# EAGLE design base_module_e1_0.2 (EAGLE 9.2.2)
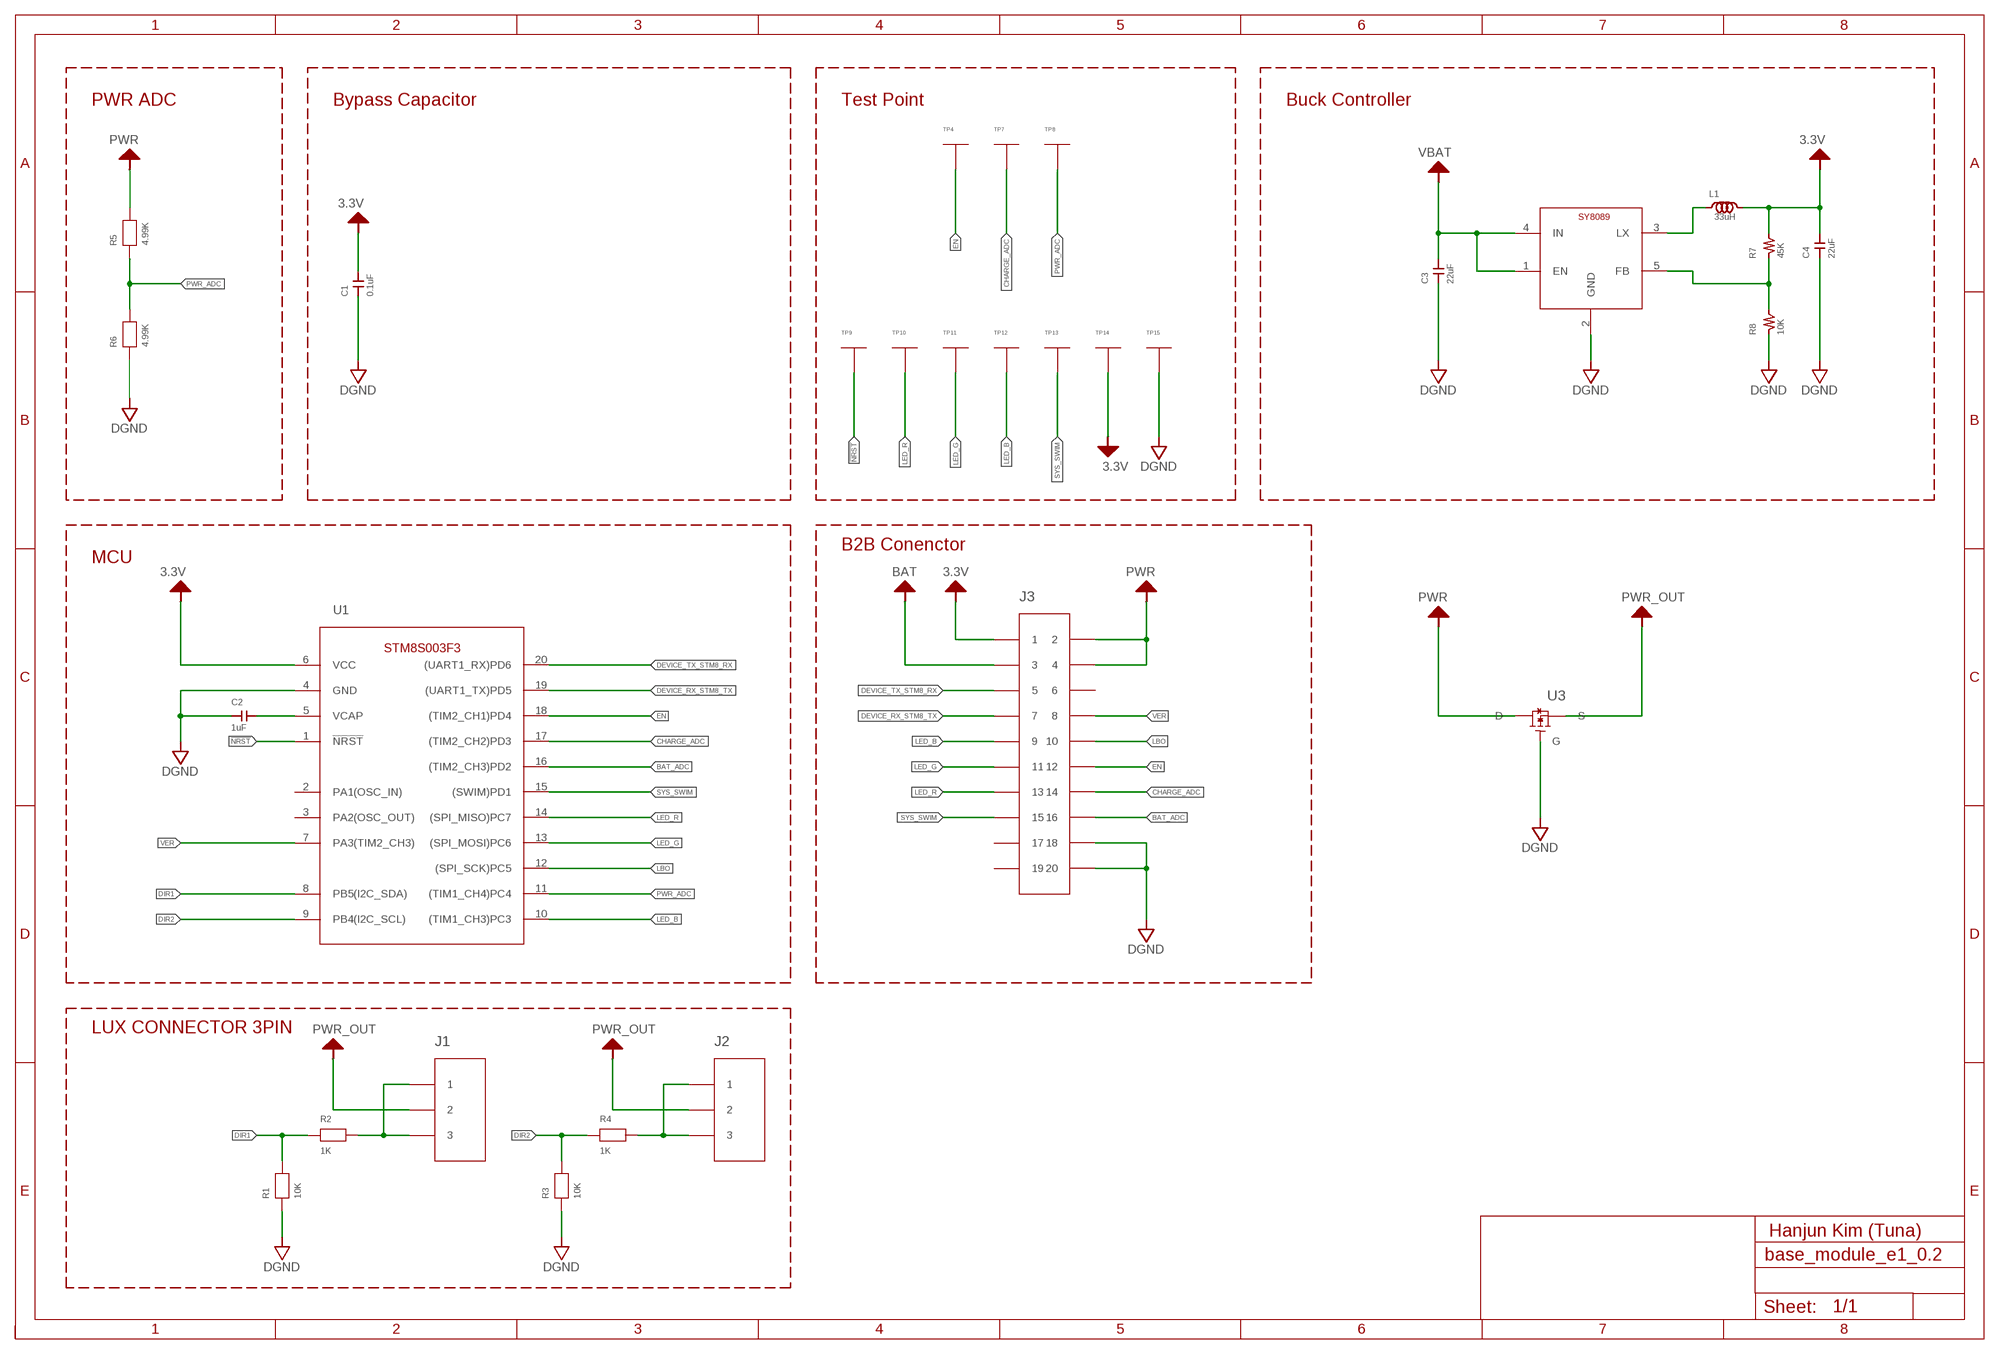
[diagram p0: schematic, sheet 1]

## Parts
C1  0.1uF  CAPACITOR_CHIP1005  [1005]
C2  1uF  CAPACITOR_CHIP1005  [1005]
C3  22uF  CAPACITOR_CHIP1608  [1608]
C4  22uF  CAPACITOR_CHIP1608  [1608]
J1  MODI_CONNECTOR_BOTTOM  [3P]
J2  MODI_CONNECTOR_BOTTOM  [3P]
J3  AXK720447G  [SOCKET_20P]
L1  33uH  INDUCTOR2518  [2518]
LOGO1  LOGO_LUXROBO_PCB  [PCB_LUXROBO_6.5X2.5]
LOGO2  LOGO_MODI_PCB6.5X2.5  [PCB_MODI_6.5X2.5]
P1  MODI_BAT_BASE  [BAT_BASE]
R1  10K  RESISTOR_CHIP_SMALL1005  [1005]
R2  1K  RESISTOR_CHIP_SMALL1005  [1005]
R3  10K  RESISTOR_CHIP_SMALL1005  [1005]
R4  1K  RESISTOR_CHIP_SMALL1005  [1005]
R5  4.99K  RESISTOR_CHIP_SMALL1005  [1005]
R6  4.99K  RESISTOR_CHIP_SMALL1005  [1005]
R7  45K  RESISTOR_CHIP_1005  [1005]
R8  10K  RESISTOR_CHIP_1005  [1005]
TP4  TEST_POINT_1.2MM_PAD  [1.2MM_PAD]
TP7  TEST_POINT_1.2MM_PAD  [1.2MM_PAD]
TP8  TEST_POINT_1.2MM_PAD  [1.2MM_PAD]
TP9  TEST_POINT_1.2MM_PAD  [1.2MM_PAD]
TP10  TEST_POINT_1.2MM_PAD  [1.2MM_PAD]
TP11  TEST_POINT_1.2MM_PAD  [1.2MM_PAD]
TP12  TEST_POINT_1.2MM_PAD  [1.2MM_PAD]
TP13  TEST_POINT  [0.7MM_HOLE]
TP14  TEST_POINT  [0.7MM_HOLE]
TP15  TEST_POINT  [0.7MM_HOLE]
U1  STM8S003FXU6  [UFQFPN20]
U2  SY8089  [SOT-23-5]
U3  PMXBXXXXPE  [DFN1010D-3]

## Nets
3.3V: C1.P$2 C4.P$2 J3.P1 L1.P$2 R7.P$2 TP14.1 U1.6(VCC)
!NRST!: TP9.P1 U1.1(!NRST!)
BAT_ADC: J3.P16 U1.16((TIM2_CH3)PD2)
CHARGE_ADC: J3.P14 TP7.P1 U1.17((TIM2_CH2)PD3)
DEVICE_RX_STM8_TX: J3.P7 U1.19((UART1_TX)PD5)
DEVICE_TX_STM8_RX: J3.P5 U1.20((UART1_RX)PD6)
DGND: C1.P$1 C2.P$1 C3.P$1 C4.P$1 J3.P18 J3.P20 R1.P$1 R3.P$1 R6.P$1 R8.P$1 TP15.1 U1.4(GND) U2.2(GND) U3.P1(G)
DIR1: R1.P$2 R2.P$1 U1.8(PB5(I2C_SDA))
DIR2: R3.P$2 R4.P$1 U1.9(PB4(I2C_SCL))
EN: J3.P12 TP4.P1 U1.18((TIM2_CH1)PD4)
LBO: J3.P10 U1.12((SPI_SCK)PC5)
LED_B: J3.P9 TP12.P1 U1.10((TIM1_CH3)PC3)
LED_G: J3.P11 TP11.P1 U1.13((SPI_MOSI)PC6)
LED_R: J3.P13 TP10.P1 U1.14((SPI_MISO)PC7)
N$1: J2.P1 J2.P3 R4.P$2
N$3: J1.P1 J1.P3 R2.P$2
N$4: R7.P$1 R8.P$2 U2.5(FB)
N$5: L1.P$1 U2.3(LX)
PWR: J3.P2 J3.P4 R5.P$2 U3.P3(D)
PWR_ADC: R5.P$1 R6.P$2 TP8.P1 U1.11((TIM1_CH4)PC4)
PWR_OUT: J1.P2 J2.P2 U3.P2(S)
SYS_SWIM: J3.P15 TP13.1 U1.15((SWIM)PD1)
VBAT: C3.P$2 J3.P3 U2.1(EN) U2.4(IN) ; supply symbol labelled BAT
VCAP: C2.P$2 U1.5(VCAP)
VER: J3.P8 U1.7(PA3(TIM2_CH3))
Unconnected: J3.P6 J3.P17 J3.P19 U1.2(PA1(OSC_IN)) U1.3(PA2(OSC_OUT))

## Notes on the sheet
- PWR ADC | Bypass Capacitor | Test Point | Buck Controller
- B2B Conenctor
- MCU
- LUX CONNECTOR 3PIN
- Hanjun Kim (Tuna)

## Library data of the parts
C1-C4 = passive:CAPACITOR_CHIP
J1 J2 = MODI_Connector:MODI_CONNECTOR_BOTTOM
J3 = connector-panasonic:AXK7204
L1 = passive:INDUCTOR
LOGO1 = LUX_Logo_new:LOGO_LUXROBO_PCB
LOGO2 = LUX_Logo_new:LOGO_MODI_PCB
P1 = MODI_board:MODI_BAT_BASE
R1-R6 = passive:RESISTOR_CHIP_SMALL
R7 R8 = passive:RESISTOR_CHIP_
TP4 TP7-TP15 = Test:TEST_POINT
U1 = ST-MCU:STM8S003FX: • 16 MHz advanced STM8 core with Harvard architecture and 3-stage pipeline • Extended instruction set Memories • Program memory: 8 Kbyte Flash memory; data retention 20 years at 55 °C after 100 cycles • RAM: 1 Kbyte • Data memory: 128 bytes true data EEPROM; endurance up to 100 k write/erase cycles Clock, reset and supply management • 2.95 V to 5.5 V operating voltage • Flexible clock control, 4 master clock sources – Low-power crystal resonator oscillator – External clock input – Internal, user-trimmable 16 MHz RC – Internal low-power 128 kHz RC • Clock security system with clock monitor • Power management – Low-power modes (wait, active-halt, halt) – Switch-off peripheral clocks individually – Permanently active, low-consumption power-on and power-down reset Interrupt management • Nested interrupt controller with 32 interrupts • Up to 27 external interrupts on 6 vectors
U2 = Regulator:SY8089: The SY8089 and SY8089A are high-efficiency, high frequency synchronous step-down DC-DC regulator IC capable of delivering up to 2A output current. The SY8089 and SY8089A operate over a wide input voltage range from 2.7V to 5.5V and integrate main switch and synchronous switch with very low RDS(ON) to minimize the conduction loss. Low output voltage ripple and small external inductor and capacitor sizes are achieved with greater than 1MHz switching frequency. SY8089 integrates short circuit and over-voltage latch off protection.
U3 = MOSFET:PMXBXXXX

## Board
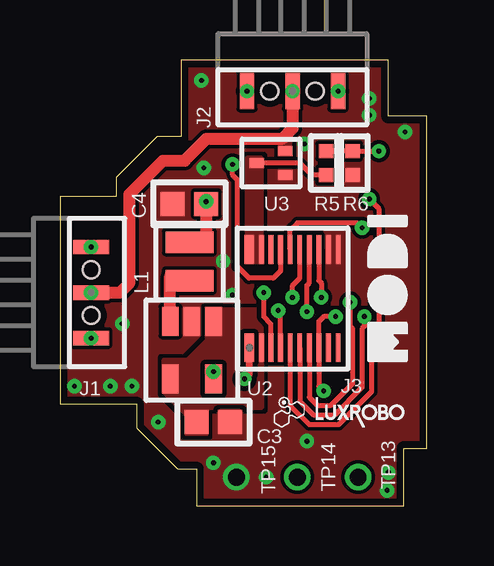
[diagram p1: board, top side]
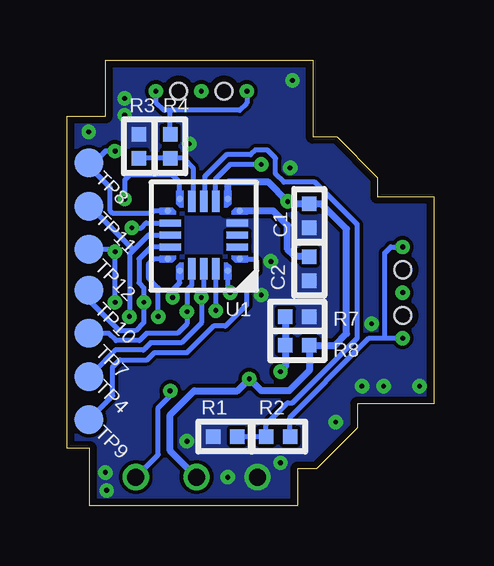
[diagram p2: board, bottom side, seen from below]

Size 15.3 x 18.6 mm. Coordinates in mm from the lower left corner, seen from the top.
Copper layers (1*16): Top 0.035mm / dielectric 0.2mm / Bottom 0.035mm
Design rules "hsdgt3_1oz_2layer *": minimum track width 0.15mm, minimum drill 0.2mm, track to track 0.15mm, track to pad 0.15mm, pad to pad 0.15mm, via to via 0.15mm, smd to smd 0mil, copper to edge 0.3mm, drill to drill 0.2mm, minimum pad ring 0.2mm, minimum via ring 0.2mm, stop-mask expansion 0mil, vias tented up to drill 0.3mm, thermal gap 10mil
bRestrict: 1 lines

### Footprints (pad centres in the part's own frame; a part is rotated, then mirrored left to right if it is on the bottom)
1005 = smd 0.6 x 0.6: P$1 0,0.5; P$2 0,-0.5
1608 = smd 1 x 1: P$1 0,0.7; P$2 0,-0.7
3P = smd 1.5 x 0.6: P1 0,1.9; P2 0,0; P3 0,-1.9 | hole 0.7: 0,-0.95; 0,0.95
SOCKET_20P = smd 1.2 x 0.4: P1 0,0.1; P2 4.1,0.1 | smd 1.2 x 0.2: P3 0,-0.4; P4 4.1,-0.4; P5 0,-0.8; P6 4.1,-0.8; P7 0,-1.2; P8 4.1,-1.2; P9 0,-1.6; P10 4.1,-1.6; P11 0,-2; P12 4.1,-2; P13 0,-2.4; P14 4.1,-2.4; P15 0,-2.8; P16 4.1,-2.8; P17 0,-3.2; P18 4.1,-3.2; P19 0,-3.6; P20 4.1,-3.6
2518 = smd 0.9 x 2: P$1 -0.8,0; P$2 0.8,0
1.2MM_PAD = smd 1.2 x 1.2: P1 0,0
0.7MM_HOLE = drill 0.7: 1 0,0
UFQFPN20 = smd 0.3 x 0.3: 1 -1.5,1; 5 -1.5,-1; 6 -1,-1.5; 10 1,-1.5; 11 1.5,-1; 15 1.5,1; 16 1,1.5; 20 -1,1.5 | smd 0.9 x 0.3: 2 -1.4,0.5; 3 -1.4,0; 4 -1.4,-0.5; 12 1.4,-0.5; 13 1.4,0; 14 1.4,0.5 | smd 0.3 x 0.9: 7 -0.5,-1.4; 8 0,-1.4; 9 0.5,-1.4; 17 0.5,1.4; 18 0,1.4; 19 -0.5,1.4
SOT-23-5 = smd 0.7 x 1.2: 1 1.8,0; 2 0.9,0; 3 0,0; 4 0,-2.4; 5 1.8,-2.4
DFN1010D-3 = smd 0.4 x 0.6: P1 0.5,0.9; P2 -0.5,0.9; P3 0,-0.3

### Placement (x,y rotation side)
C1  5.2,12.1 180 bottom
C2  5.2,9.9 180 bottom
C3  6.4,3.5 270 top
C4  5.4,12.6 90 top
J1  1.3,8.9 180 top
J2  9.7,17.3 90 top
J3  8,6.6 90 top
L1  5.4,10.2 90 top
LOGO1  8.5,3 0 top
LOGO2  14.5,6 90 top
P1  5.7,0 0 top
R1  8.7,2.9 90 bottom
R2  6.5,2.9 90 bottom
R3  12.3,15 0 bottom
R4  11,15 180 bottom
R5  11.1,14.3 0 top
R6  12.2,14.3 180 top
R7  5.7,6.7 90 bottom
R8  5.7,7.9 270 bottom
TP4  14.4,5.4 0 bottom
TP7  14.4,7.2 180 bottom
TP8  14.4,14.3 0 bottom
TP9  14.4,3.6 0 bottom
TP10  14.4,9 0 bottom
TP11  14.4,12.5 0 bottom
TP12  14.4,10.7 0 bottom
TP13  12.44,1.2 0 top
TP14  9.9,1.2 0 top
TP15  7.36,1.2 0 top
U1  9.6,11.3 180 bottom
U2  4.6,7.7 0 top
U3  8.5,14.3 270 top

### Tracks (layer width: path | path; a pad name or v marks a point on that pad's centre or on a via)
3.3V  (via drill 0.2 pad 0.2)
  Top 0.3: v7.7,5.3 7.9,5.5 J3.P1 | C4.P$2 v6.1,12.7
  Top 0.5: L1.P$2 6.1,11 C4.P$2
  Bottom 0.3: U1.6 8.6,13.5 6.9,13.5 v6.1,12.7 6,12.6 C1.P$2 4.7,12.6 3.65,11.55 3.65,7.19 4.14,6.7 R7.P$2 5.2,5.65 6.04,4.81 6.04,4.8 7.2,4.8 v7.7,5.3 8.2,4.8 10,4.8 11,3.8 11,2.3 TP14.1
!NRST!
  Bottom 0.2: U1.1 7.5,10.3 7.4,10.2 7.4,9.8 7.8,9.4 7.8,8.4 8.7,7.5 9.2,7.5 10.3,6.4 11.65,6.4 11.95,6.1 13.1,6.1 13.4,5.8 13.4,4.6 TP9.P1
BAT_ADC  (via drill 0.2)
  Top 0.2: J3.P16 10.8,9.4 10.9,9.3 v10.9,8.7
  Bottom 0.2: v10.9,8.7 10.9,9 10.6,9.3 U1.16
CHARGE_ADC  (via drill 0.2)
  Top 0.2: v10.3,8.1 10.3,9.2 10.4,9.3 J3.P14
  Bottom 0.2: U1.17 10.1,9.2 10.3,9 v10.3,8.1 10.3,7.6 10.7,7.2 11.99,7.2 12.29,6.9 13.27,6.9 13.57,7.2 TP7.P1
DEVICE_RX_STM8_TX  (via drill 0.2)
  Top 0.2: J3.P7 9.2,8.15 v9.1,8.15
  Bottom 0.2: U1.19 v9.1,8.15
DEVICE_TX_STM8_RX  (via drill 0.2)
  Top 0.2: J3.P5 8.8,7.6 8.5,7.9 v8.5,8.9
  Bottom 0.2: U1.20 8.6,9 v8.5,8.9
DGND  (via drill 0.2 pad 0.2)
  other vias: 4.1,3.5 10.3,2.7 13.7,1.4 13.65,0.65 0.6,5 6.8,10.2 12.9,17 12.9,16.3 14.4,15.6 8.6,1.2 6.4,1.8 7.2,8.8 10.2,15.1 3,5 2.1,5 2.6,7.6 5.9,17.75 6,14.1
  pour Top (isolate 0.15, rank 6, no thermals): 0,19.7 15.4,19.7 15.4,0 0,0
  pour Bottom (isolate 0.15, rank 6, no thermals): 0,19.7 15.4,19.7 15.4,0 0,0
DIR1
  Bottom 0.2: U1.8 9.55,12.75 9.55,13.75 8.65,14.65 7.65,14.65 7.45,14.85 6.95,14.85 6.6,14.5 6.6,13.84 6.26,13.5 4.96,13.5 3.2,11.74 3.2,7 5.9,4.3 6.1,4.3 7,3.4 R2.P$1 R1.P$2
DIR2
  Bottom 0.2: U1.9 10.05,12.75 10.05,14.12 10.43,14.5 R4.P$1 R3.P$2
EN  (via drill 0.2)
  Top 0.2: v9.7,8.7 9.7,9.2 10,9.5 J3.P12
  Bottom 0.2: U1.18 9.6,8.8 v9.7,8.7 9.7,7.63 10.53,6.8 11.82,6.8 12.12,6.5 13.3,6.5 14.2,5.6 14.2,5.4 TP4.P1
LBO  (via drill 0.2 pad 0.2)
  Top 0.2: J3.P10 9.6,11.5 9.9,11.8 12.4,11.8 v12.6,11.6
  Bottom 0.2: v12.6,11.6 12.2,11.6 12,11.8 U1.12
LED_B  (via drill 0.2 pad 0.2)
  Top 0.2: J3.P9 9.6,4.2 10.4,3.4 11.63,3.4 13,4.77 13,7.2 13.3,7.5 v13.3,8.5 | v12.9,12.8 13.3,12.4 v13.3,10.6
  Bottom 0.2: U1.10 10.6,13.5 10.9,13.8 12.7,13.8 12.9,13.6 v12.9,12.8 | v13.3,8.5 v13.3,10.6 13.4,10.7 TP12.P1
LED_G  (via drill 0.2 pad 0.2)
  Top 0.2: J3.P11 10,4.37 10.57,3.8 11.47,3.8 12.6,4.93 12.6,7.4 12.7,7.5 v12.7,7.9
  Bottom 0.2: U1.13 11.9,11.3 12.53,10.68 | 12.53,10.68 12.7,10.5 v12.7,7.9 | 12.53,10.68 12.9,11.05 14.35,12.5 TP11.P1
LED_R  (via drill 0.2 pad 0.2)
  Top 0.2: J3.P13 10.4,4.53 10.73,4.2 11.3,4.2 12.2,5.1 12.2,7.4 12.1,7.5 v12.1,8.5
  Bottom 0.2: U1.14 11.8,10.8 12.3,10.3 12.3,9.3 12.1,9.1 v12.1,8.5 12.1,7.65 12.45,7.3 13.1,7.3 14.4,8.6 TP10.P1
N$1  (via drill 0.2 pad 0.2)
  Bottom 0.2: J2.P3 11.6,16.85 11.25,16.5 10.95,16.5 | J2.P1 7.8,16.8 8.1,16.5 10.95,16.5 | 10.95,16.5 11,16.45 R4.P$2
  other vias: 11.6,17.3 7.8,17.3
N$3  (via drill 0.2)
  Bottom 0.2: R2.P$2 6,3.7 5.8,3.9 4.5,5.2 4.5,5.21 2.71,7 2.7,7 2.05,7 | 2.05,7 J1.P1 | 2.05,7 2.05,10.55 1.8,10.8 J1.P3
  other vias: 1.3,7 1.3,10.8
N$4  (via drill 0.2 pad 0.2)
  Top 0.3: v6.4,5.6 U2.5
  Bottom 0.3: v6.4,5.6 6.2,5.8 R7.P$1 R8.P$2
N$5
  Top 0.5: U2.3 4.6,9.6 5.4,9.6 L1.P$1
PWR
  Top 0.2: U3.P3 10,14.3 10.5,13.8 R5.P$2
  pour Top (isolate 0.2, no thermals): 7.8,10.2 8.4,10.2 8.4,14.5 7.8,14.5
PWR_ADC  (via drill 0.2 pad 0.2)
  Top 0.2: R5.P$1 R6.P$2 v13.3,14.8
  Bottom 0.2: U1.11 11.7,12.3 11.8,12.2 13.4,12.2 13.5,12.3 13.5,13.27 14.3,14.07 14.3,14.2 | v13.3,14.8 13.7,14.8 14.3,14.2 | TP8.P1 14.4,14.2 14.3,14.2
PWR_OUT  (via drill 0.2, 0.2 pad 0.2)
  Top 0.5: J2.P2 9.7,15.75 9.25,15.3 6.1,15.3 5.2,14.4 4.3,14.4 2.9,13 2.9,9.3 2.5,8.9 J1.P2
  other vias: 9.7,17.3 1.3,8.9
  pour Top (isolate 0.2, no thermals): 9.2,15.4 9.6,15.4 9.6,14.7
  pour Top (isolate 0.2, no thermals): 9.2,14.7 9.2,15.4 9.6,15.4 9.6,14.7
SYS_SWIM  (via drill 0.2)
  Top 0.2: v11.5,7.9 11,7.9 10.8,7.7 J3.P15 10.8,5 v11,4.8
  Bottom 0.2: U1.15 11.7,10.3 11.9,10.1 11.9,9.5 11.5,9.1 v11.5,7.9 | TP13.1 11.5,2.14 11.5,4.1 11,4.6 v11,4.8
VBAT
  pour Top (isolate 0.2, rank 2, no thermals): 6.15,8.2 8.4,8.2 8.4,4.1 6.1,4.1 6.1,3 5.3,3 5.3,3.8 4.35,4.75 4.35,6.1 5.35,6.1 6.15,6.9
VCAP
  Bottom 0.3: C2.P$2 5.8,10.4 6.1,10.7 6.1,11.7 6.7,12.3 U1.5
VER  (via drill 0.2 pad 0.2)
  Top 0.2: J3.P8 9.2,9.8 8.9,9.5 7.88,9.5 7.4,9.98 7.4,13.6 7.2,13.8 v7.2,14.25
  Bottom 0.2: U1.7 9.1,13.64 8.49,14.25 v7.2,14.25